# Altium schematic sheet Transistor - BJT.SchDoc
size A3; SheetNumber: 39; SheetTotal: 39
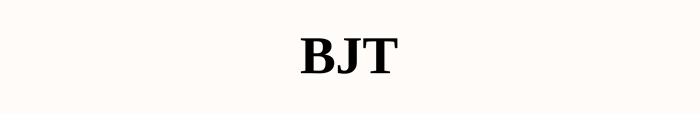
[diagram p0: Transistor - BJT.SchDoc]

## Notes on the sheet
- BJT